# Altium schematic sheet M_PWR.SchDoc
size Letter
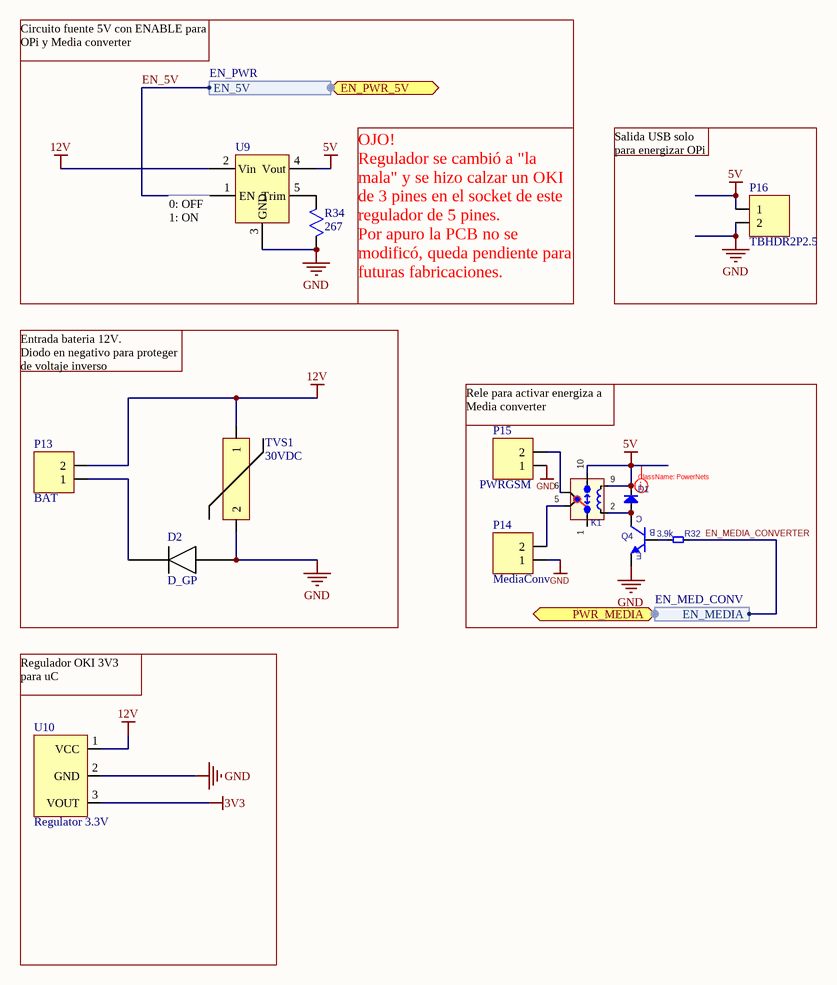
[diagram p0: M_PWR.SchDoc]

## Parts
D1  DIODE_EIL  [DIOD_SOD123 - REFLOW]  (value not drawn)
D2  D_GP  [SMA]
K1  RELAY_METALTEX_MB1RC-5V_SPDT_EIL  [RELAY_METALTEX_MB1RC-5V_SPDT THR]  (value not drawn)
P13  BAT  [TBHDR2P3.5VERTICAL]
P14  MediaConv  [TBHDR2P3.5VERTICAL]
P15  PWRGSM  [TBHDR2P3.5VERTICAL]
P16  TBHDR2P2.5  [TBR2.5]
Q4  TRAN_BJT_NPN_EIL  [3PIN_SOT-23 BJT - REFLOW]  (value not drawn)
R32  value 3.9k  [PASS_RESC0603 - REFLOW]  (hidden comment: PASS_R_EIL)
R34  267  [ResistorSMD0805]
TVS1  30VDC  [Varistor]
U9  DCDC 5V/3A  [OKR]  (value not drawn)
U10  Regulator 3.3V  [OKI78SR]

## Ports
EN_PWR_5V (harness EN_PWR), PWR_MEDIA (harness EN_MED_CONV)

## Harnesses
EN_PWR: EN_5V
EN_MED_CONV: EN_MEDIA

## Nets
3V3: U10.3(VOUT)
5V: D1.K K1.9 K1.10 P16.1 U9.4(Vout)
12V: P13.2 TVS1.1 U9.2(Vin) U10.1(VCC)
GND: D2.2 P14.1 P15.1 P16.2 Q4.E R34.2 TVS1.2 U9.3(GND) U10.2(GND)
EN_5V: U9.1(EN) ; port EN_PWR_5V.EN_5V
EN_MEDIA_CONVERTER: R32.2 ; port PWR_MEDIA.EN_MEDIA
NetD1_A: D1.A K1.2 Q4.C
NetD2_1: D2.1 P13.1
NetK1_5: K1.5 P14.2
NetK1_6: K1.6 P15.2
NetQ4_B: Q4.B R32.1
NetR34_1: R34.1 U9.5(Trim)

Not connected (* = marked no-connect by the designer): K1 1

## Layout directives
net class PowerNets: 5V

## Notes on the sheet
- Circuito fuente 5V con ENABLE para OPi y Media converter
- Salida USB solo para energizar OPi
- (near U9) 0: OFF
  1: ON
- (near R34) OJO!
  Regulador se cambió a "la mala" y se hizo calzar un OKI de 3 pines en el socket de este regulador de 5 pines.
  Por apuro la PCB no se modificó, queda pendiente para futuras fabricaciones.
- Entrada bateria 12V.
  Diodo en negativo para proteger de voltaje inverso
- (near P15) Rele para activar energiza a Media converter
- Regulador OKI 3V3 para uC

## Library data of the parts
D1 = DIODE_EIL: DIODE GEN PURP 100V 150MA SOD123; PartNo: 1N4148W-TP; Manufacturer Name: Micro Commercial Co; Value: 1N4148; Type: Surface Mount; Package: SOD-123; Digi-Key Part Number: 1N4148WTPMSCT-ND; Distributors Part Number: 1N4148WTPMSCT-ND; Manufacturers Part Number: 1N4148W-TP; PartDescription: DIODE GEN PURP 100V 150MA SOD123
D2 = D_GP: Single Diode Rectifier SMD; PartNo: CDBA540-HF; Manufacturer Name: Comchip Technology; PartDescription: DIODE SCHOTTKY 40V 5A DO214AC; Type: Surface Mount; Digi-Key Part Number: 641-1707-1-ND; Package: DO-214AC, SMA; Distributors Part Number: 641-1707-1-ND; Manufacturers Part Number: CDBA540-HF
K1 = RELAY_METALTEX_MB1RC-5V_SPDT_EIL: RELAY GENERAL PURPOSE SPDT 1A 5V; PartNo: G5V-1-DC5; Manufacturer Name: Panasonic Electric Works; PartDescription: RELAY TELECOM SPDT 1A 5VDC; Value: 5V/CONTACTO 1A; Package: *; Digi-Key Part Number: 255-1092-ND; Distributors Part Number: 255-1092-ND; Manufacturers Part Number: G5V-1-DC5; Type: Through Hole
P13-P15 = TBHDR2P3.5: Connector 2 positions with pitch 3.5mm; PartNo: 691321100002; Manufacturer Name: Wurth Electronics Inc.; PartDescription: TERM BLOCK HDR 2POS VERT 3.5MM; Digi-Key Part Number: 732-2763-ND; Package: 0.138" (3.50mm) Vertical Through Hole; Distributors Part Number: 732-2763-ND; Manufacturers Part Number: 691321100002; Type: Through Hole; Value: 2 Position
P16 = TBHDR2P3.5: Connector 2 positions with pitch 3.5mm; Manufacturer Name: Phoenix Contact; Manufacturers Part Number: 1778625; PartDescription: TERM BLOCK HDR 2POS 90DEG 2.5MM; Digi-Key Part Number: 277-2308-1-ND; Distributors Part Number: 277-2308-1-ND; PartNo: 1778625; Type: Through Hole
Q4 = TRAN_BJT_NPN_EIL: TRANS NPN 45V 0.5A SOT23; PartNo: BC817-40LT1G; Manufacturer Name: ON Semiconductor; Type: Surface Mount; Package: TO-236-3, SC-59, SOT-23-3; Digi-Key Part Number: BC817-40LT1GOSCT-ND; Distributors Part Number: BC817-40LT1GOSCT-ND; Manufacturers Part Number: BC817-40LT1G; PartDescription: TRANS NPN 45V 0.5A SOT23
R32 = PASS_R_EIL: RES SMD 3.9K OHM 1% 1/10W 0603; PartNo: RC0603FR-073K9L; Manufacturer Name: Yageo; Package: 0603 (1608 Metric); Digi-Key Part Number: 311-3.90KHRCT-ND; Distributors Part Number: 311-3.90KHRCT-ND; Manufacturers Part Number: RC0603FR-073K9L; PartDescription: RES SMD 3.9K OHM 1% 1/10W 0603; Type: Surface Mount
R34 = ResistorSMD: Chip Resistor SMD; Manufacturer Name: Panasonic Electronic Components; Manufacturers Part Number: ERJ-PB3D2670V; PartDescription: RES SMD 267 OHM 0.5% 1/5W 0603; Digi-Key Part Number: P20215CT-ND; Value: 267; Distributors Part Number: P20215CT-ND; Package: 0603 (1608 Metric); PartNo: ERJ-PB3D2670V; Type: Surface Mount
TVS1 = Varistor: Varistor SMD; Manufacturer Name: Panasonic Electronic Components; Manufacturers Part Number: ERZ-VF2M330; PartDescription: VARISTOR 33V 125A 2SMD JLEAD; Digi-Key Part Number: P7347CT-ND; Distributors Part Number: P7347CT-ND; Package: 2-SMD, J-Lead; PartNo: ERZ-VF2M330; Type: Surface Mount
U9 = DCDC 5V/3A: Non-Isolated PoL Module DC DC Converter 1 Output 0.59 ~ 6 V 3A 4.5V - 14V Input; PartNo: OKR-T/3-W12-C; Manufacturer Name: Murata Power Solutions Inc.; PartDescription: DC DC CONVERTER 0.59-6V 15W; Digi-Key Part Number: 811-2115-5-ND; Package: 5-SIP Module; Distributors Part Number: 811-2115-5-ND; Manufacturers Part Number: OKR-T/3-W12-C; Type: Through Hole
U10 = OKI78SR: Regulator DC-DC 3.3V 1.5A; PartNo: OKI-78SR-3.3/1.5-W36-C; Manufacturer Name: Murata Power Solutions Inc.; PartDescription: DC DC CONVERTER 3.3V 5W; Digi-Key Part Number: 811-2195-5-ND; Package: 3-SIP Module; Distributors Part Number: 811-2195-5-ND; Manufacturers Part Number: OKI-78SR-3.3/1.5-W36-C; Type: Through Hole